# EAGLE design filters (EAGLE 5.06)
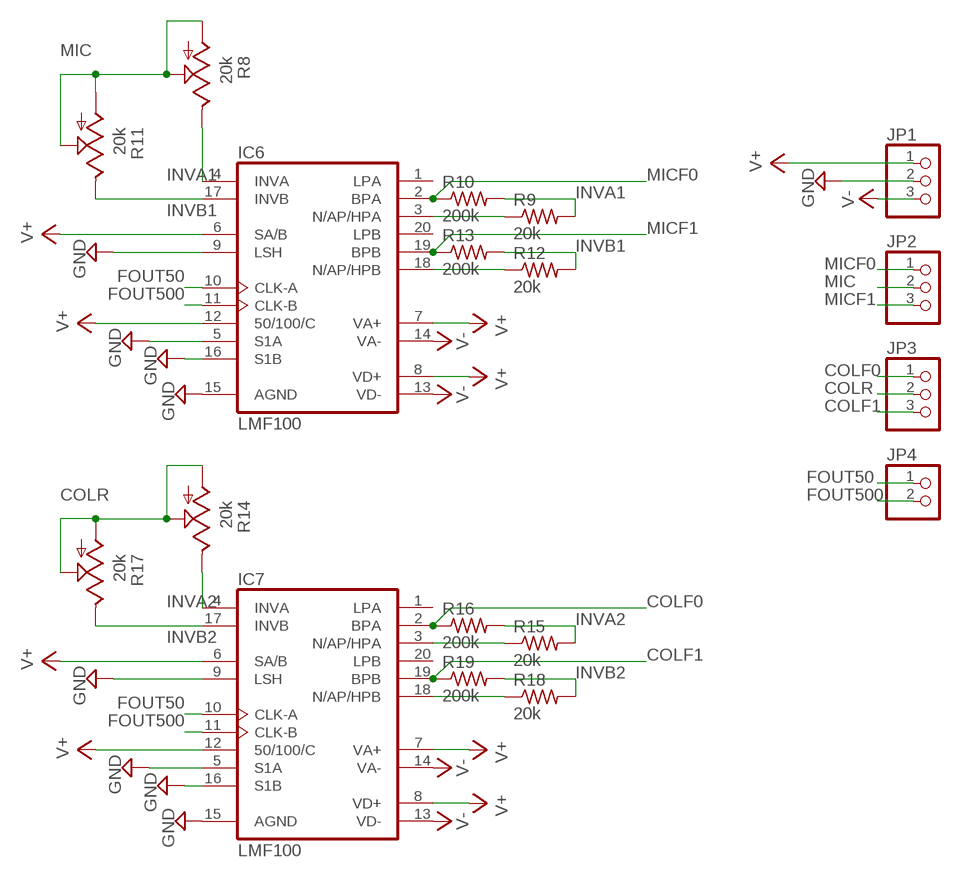
[diagram p0: schematic, sheet 1]

## Parts
IC6  LMF100  [SO20W]
IC7  LMF100  [SO20W]
JP1  PINHD-1X3  [1X03]
JP2  PINHD-1X3  [1X03]
JP3  PINHD-1X3  [1X03]
JP4  PINHD-1X2  [1X02]
R8  20k  TRIM_US-CT6  [CT6]
R9  20k  R-US_R1206  [R1206]
R10  200k  R-US_R1206  [R1206]
R11  20k  TRIM_US-CT6  [CT6]
R12  20k  R-US_R1206  [R1206]
R13  200k  R-US_R1206  [R1206]
R14  20k  TRIM_US-CT6  [CT6]
R15  20k  R-US_R1206  [R1206]
R16  200k  R-US_R1206  [R1206]
R17  20k  TRIM_US-CT6  [CT6]
R18  20k  R-US_R1206  [R1206]
R19  200k  R-US_R1206  [R1206]

## Nets
COLF0: IC7.2(BPA) JP3.1 R16.1
COLF1: IC7.19(BPB) JP3.3 R19.1
COLR: JP3.2 R14.A R14.S R17.A R17.S
FOUT50: IC6.10(CLK-A) IC7.10(CLK-A) JP4.1
FOUT500: IC6.11(CLK-B) IC7.11(CLK-B) JP4.2
GND: IC6.5(S1A) IC6.9(LSH) IC6.15(AGND) IC6.16(S1B) IC7.5(S1A) IC7.9(LSH) IC7.15(AGND) IC7.16(S1B) JP1.2
INVA1: IC6.4(INVA) R8.E R9.2 R10.2
INVA2: IC7.4(INVA) R14.E R15.2 R16.2
INVB1: IC6.17(INVB) R11.E R12.2 R13.2
INVB2: IC7.17(INVB) R17.E R18.2 R19.2
MIC: JP2.2 R8.A R8.S R11.A R11.S
MICF0: IC6.2(BPA) JP2.1 R10.1
MICF1: IC6.19(BPB) JP2.3 R13.1
N$1: IC6.3(N/AP/HPA) R9.1
N$5: IC6.18(N/AP/HPB) R12.1
N$17: IC7.3(N/AP/HPA) R15.1
N$19: IC7.18(N/AP/HPB) R18.1
V+: IC6.6(SA/B) IC6.7(VA+) IC6.8(VD+) IC6.12(50/100/C) IC7.6(SA/B) IC7.7(VA+) IC7.8(VD+) IC7.12(50/100/C) JP1.1
V-: IC6.13(VD-) IC6.14(VA-) IC7.13(VD-) IC7.14(VA-) JP1.3
Unconnected: IC6.1(LPA) IC6.20(LPB) IC7.1(LPA) IC7.20(LPB)

## Library data of the parts
IC6 IC7 = LMF100:LMF100
JP1-JP3 = pinhead:PINHD-1X3: PIN HEADER
JP4 = pinhead:PINHD-1X2: PIN HEADER
R8 R11 R14 R17 = pot:TRIM_US-: POTENTIOMETER
R9 R10 R12 R13 R15 R16 R18 R19 = resistor:R-US_: RESISTOR, American symbol

## Board
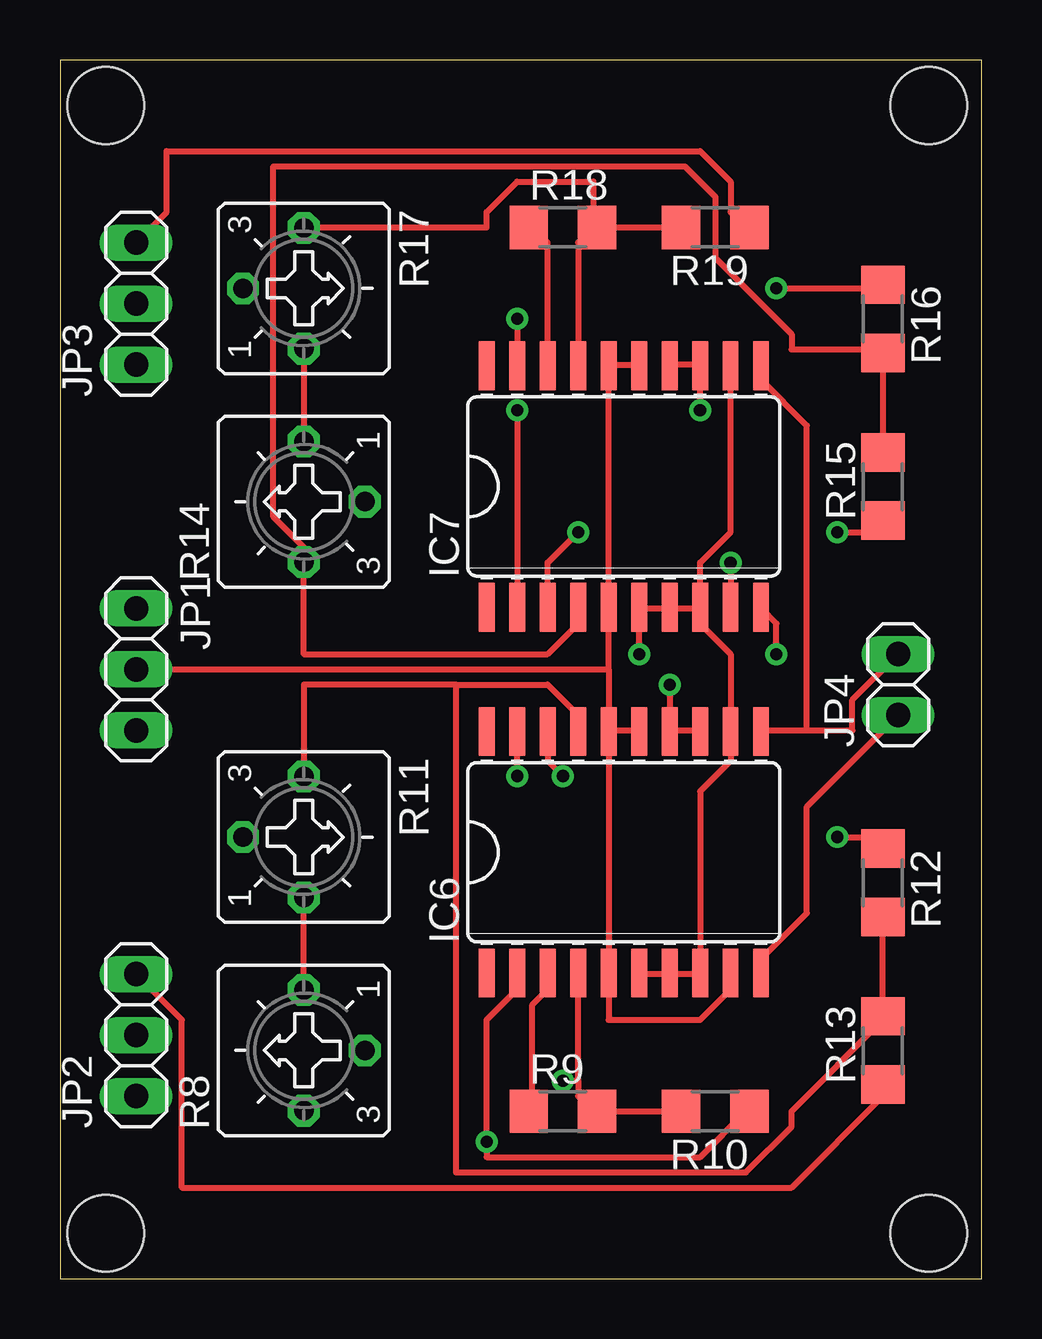
[diagram p1: board, top side]
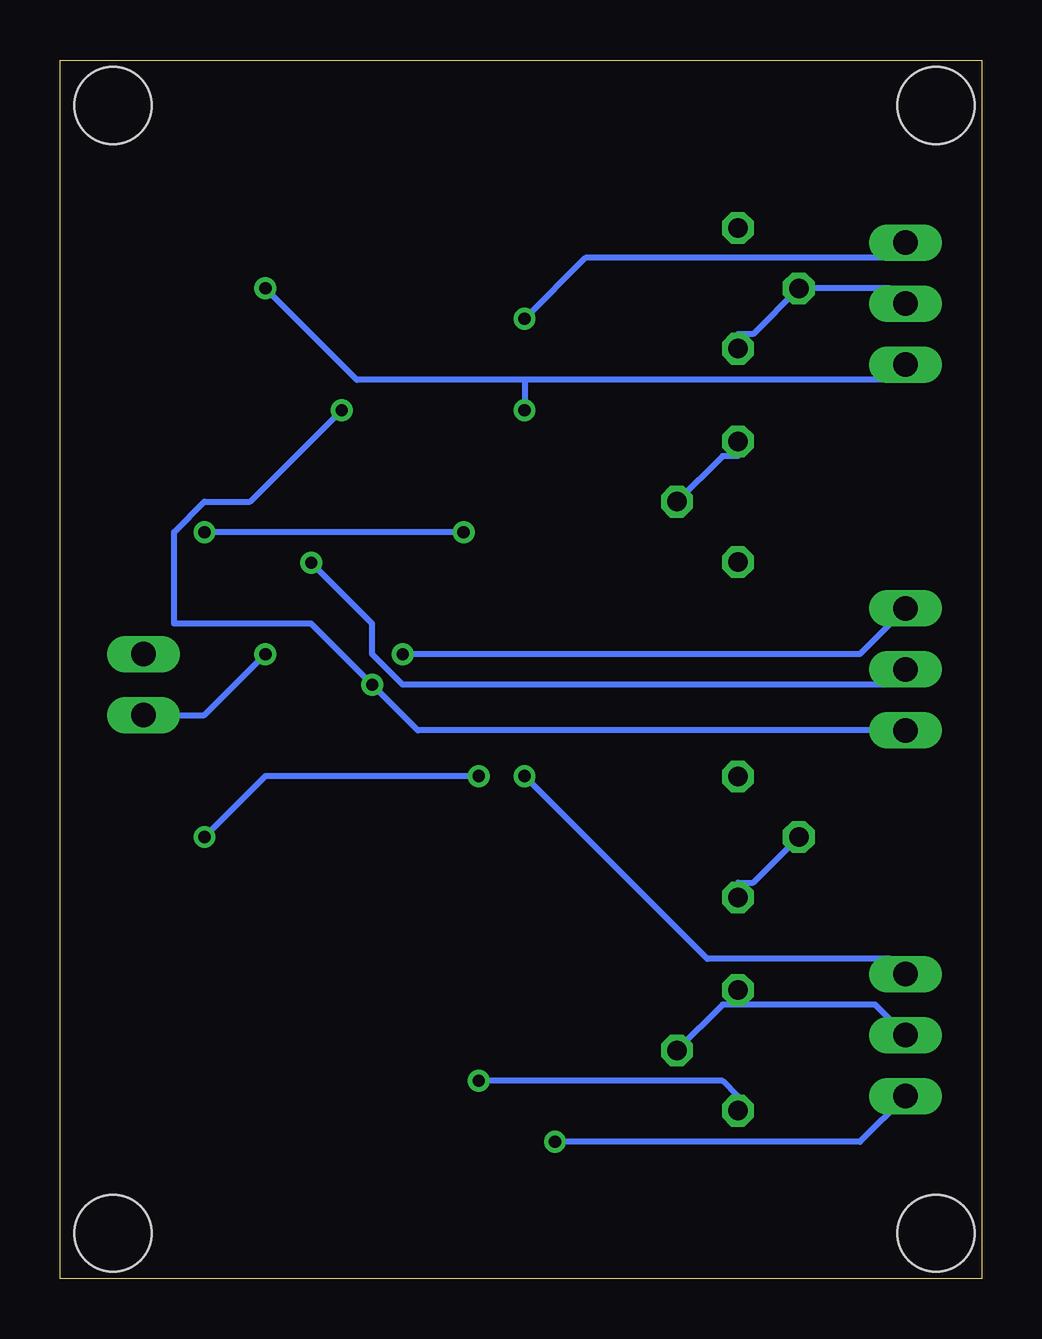
[diagram p2: board, bottom side, seen from below]

Size 38.41 x 50.79 mm. Coordinates in mm from the lower left corner, seen from the top.
Outline: 0,0 38.41,0 38.41,50.79 0,50.79 0,0
Copper layers (1*16): Top 0.035mm / dielectric 1.5mm / Bottom 0.035mm
Design rules "default *": minimum track width 10mil, minimum drill 20mil, track to track 10mil, track to pad 10mil, pad to pad 10mil, via to via 10mil, smd to smd 10mil, copper to edge 40mil, drill to drill 8mil, minimum pad ring 10mil, minimum via ring 8mil, stop-mask expansion 4mil, vias tented up to drill 0mil, thermal gap 10mil
Holes 3.2 mm at 1.91,1.91 36.2,1.91 1.91,48.9 36.2,48.9

### Footprints (pad centres in the part's own frame; a part is rotated, then mirrored left to right if it is on the bottom)
SO20W = smd 0.66 x 2.032: 1 -5.715,-5.029; 2 -4.445,-5.029; 3 -3.175,-5.029; 4 -1.905,-5.029; 5 -0.635,-5.029; 6 0.635,-5.029; 7 1.905,-5.029; 8 3.175,-5.029; 9 4.445,-5.029; 10 5.715,-5.029; 11 5.715,5.029; 12 4.445,5.029; 13 3.175,5.029; 14 1.905,5.029; 15 0.635,5.029; 16 -0.635,5.029; 17 -1.905,5.029; 18 -3.175,5.029; 19 -4.445,5.029; 20 -5.715,5.029
1X03 = drill 1.016 long: 1 -2.54,0; 2 0,0; 3 2.54,0
1X02 = drill 1.016 long: 1 -1.27,0; 2 1.27,0
CT6 = drill 0.813 octagon: A 2.515,0; E -2.515,0; S 0,-2.54
R1206 = smd 1.6 x 1.803: 1 -1.422,0; 2 1.422,0

### Placement (x,y rotation side)
IC6  23.5,17.78 0 top
IC7  23.5,33.02 0 top
JP1  3.17,25.4 270 top
JP2  3.17,10.16 90 top
JP3  3.17,40.64 90 top
JP4  34.92,24.77 90 top
R8  10.16,9.53 90 top
R9  20.95,6.99 0 top
R10  27.3,6.99 180 top
R11  10.16,18.41 270 top
R12  34.29,16.51 270 top
R13  34.29,9.53 90 top
R14  10.16,32.38 90 top
R15  34.29,33.02 90 top
R16  34.29,40.01 270 top
R17  10.16,41.27 270 top
R18  20.95,43.81 0 top
R19  27.3,43.81 180 top

### Tracks (layer width: path | path; a pad name or v marks a point on that pad's centre or on a via)
COLF0  (via drill 0.51)
  Top 0.254: v29.84,41.27 34.29,41.27 R16.1 | v19.05,36.2 IC7.2
  Bottom 0.254: v29.84,41.27 26.04,37.47 19.05,37.47 | 19.05,37.47 3.81,37.47 JP3.1 | 19.05,37.47 v19.05,36.2
COLF1  (via drill 0.51)
  Top 0.254: JP3.3 4.45,44.45 4.45,46.99 26.67,46.99 27.94,45.72 27.94,44.45 28.57,43.81 R19.1 | v19.05,40.01 IC7.19
  Bottom 0.254: v19.05,40.01 16.51,42.55 3.81,42.55 JP3.3
COLR
  Top 0.254: R17.A R14.A
  Bottom 0.254: R14.S 10.79,34.29 10.16,34.29 R14.A | R17.A 10.16,39.37 9.53,39.37 R17.S 3.81,41.27 JP3.2
FOUT50  (via drill 0.51)
  Top 0.254: JP4.1 31.11,19.68 31.11,15.24 29.21,13.34 IC6.10 | v29.84,26.04 29.84,27.3 29.21,27.94 IC7.10
  Bottom 0.254: v29.84,26.04 32.38,23.5 JP4.1
FOUT500
  Top 0.254: 31.11,22.86 33.02,22.86 33.02,24.13 JP4.2 | 31.11,22.86 29.21,22.86 IC6.11 | 31.11,22.86 31.11,35.56 29.21,37.47 IC7.11
GND  (via drill 0.51)
  Top 0.254: v27.94,29.84 IC7.9 | IC7.15 24.13,38.1 22.86,38.1 IC7.16 IC7.5 22.86,25.4 | 22.86,25.4 22.86,22.86 | IC6.9 27.94,12.06 26.67,10.79 22.86,10.79 IC6.5 IC6.16 22.86,22.86 | 22.86,22.86 24.13,22.86 IC6.15 | JP1.2 22.86,25.4
  Bottom 0.254: v27.94,29.84 25.4,27.3 25.4,26.04 24.13,24.77 3.81,24.77 JP1.2
INVA1  (via drill 0.51)
  Top 0.254: R10.2 R9.2 22.23,6.99 21.59,7.62 21.59,8.26 | 21.59,8.26 IC6.4 | v20.95,8.26 21.59,8.26
  Bottom 0.254: v20.95,8.26 10.79,8.26 10.16,7.62 R8.E
INVA2
  Top 0.254: R15.2 R16.2 34.29,38.73 30.48,38.73 30.48,39.37 27.3,42.55 27.3,45.09 26.04,46.35 8.89,46.35 8.89,31.75 10.16,30.48 R14.E 10.16,26.04 20.32,26.04 21.59,27.3 IC7.4
INVB1
  Top 0.254: R12.2 R13.2 34.29,10.79 30.48,6.99 30.48,6.35 28.57,4.45 16.51,4.45 16.51,24.77 | 16.51,24.77 10.16,24.77 R11.E | 16.51,24.77 20.32,24.77 21.59,23.5 IC6.17
INVB2
  Top 0.254: R19.2 R18.2 22.23,43.81 | 22.23,43.81 21.59,43.18 IC7.17 | 22.23,43.81 22.23,45.72 19.05,45.72 17.78,44.45 17.78,43.81 10.16,43.81 R17.E
MIC
  Top 0.254: R8.A R11.A
  Bottom 0.254: R11.S 9.53,16.51 10.16,16.51 R11.A | R8.S 10.79,11.43 10.16,11.43 | JP2.2 4.45,11.43 10.16,11.43 | 10.16,11.43 R8.A
MICF0  (via drill 0.51)
  Top 0.254: R10.1 28.57,6.99 26.67,5.08 17.78,5.08 v17.78,5.71 17.78,10.79 19.05,12.06 IC6.2
  Bottom 0.254: JP2.1 5.08,5.71 v17.78,5.71
MICF1  (via drill 0.51)
  Top 0.254: JP2.3 5.08,10.79 5.08,3.81 30.48,3.81 34.29,7.62 R13.1 | v19.05,20.95 IC6.19
  Bottom 0.254: v19.05,20.95 11.43,13.34 3.81,13.34 JP2.3
N$1
  Top 0.254: R9.1 19.68,6.99 19.68,11.43 20.32,12.06 IC6.3
N$5  (via drill 0.51)
  Top 0.254: v32.38,18.41 34.29,18.41 R12.1 | v20.95,20.95 20.32,21.59 IC6.18
  Bottom 0.254: v32.38,18.41 29.84,20.95 v20.95,20.95
N$17  (via drill 0.51)
  Top 0.254: v32.38,31.11 34.29,31.11 R15.1 | v21.59,31.11 20.32,29.84 IC7.3
  Bottom 0.254: v21.59,31.11 v32.38,31.11
N$19
  Top 0.254: R18.1 19.68,43.81 20.32,43.18 IC7.18
V+  (via drill 0.51)
  Top 0.254: 25.4,12.7 24.13,12.7 IC6.6 | 25.4,12.7 26.67,12.7 IC6.8 26.67,20.32 27.94,21.59 IC6.12 27.94,26.04 26.67,27.3 26.67,27.94 | 25.4,12.7 IC6.7 | 24.13,27.94 25.4,27.94 | 25.4,27.94 26.67,27.94 | 25.4,27.94 IC7.7 | 26.67,27.94 IC7.8 26.67,29.84 27.94,31.11 IC7.12 | v24.13,26.04 24.13,27.94 | 24.13,27.94 IC7.6
  Bottom 0.254: JP1.1 5.08,26.04 v24.13,26.04
V-  (via drill 0.51)
  Top 0.254: IC7.14 25.4,38.1 26.67,38.1 IC7.13 v26.67,36.2 | 25.4,22.86 26.67,22.86 IC6.13 | v25.4,24.77 25.4,22.86 | 25.4,22.86 IC6.14
  Bottom 0.254: JP1.3 23.5,22.86 v25.4,24.77 27.94,27.3 33.66,27.3 33.66,31.11 32.38,32.38 30.48,32.38 v26.67,36.2